# Altium schematic sheet Channel.SchDoc: CDR, Fanout, D-FF
size 420 x 297 mm; CheckedBy: E.Orzes F.Martina S.Baron; CompanyName: CERN; DrawnBy: E.Orzes; Organization: CERN; Address1: European Organization for Nuclear Research; Address2: CH-1211 Genève 23 - Switzerland; SheetNumber: 6; SheetTotal: 7; Projet: Phase Stable Link; DivGrp: EP-ESE; Designer: E.Orzes; ModifiedDate: -
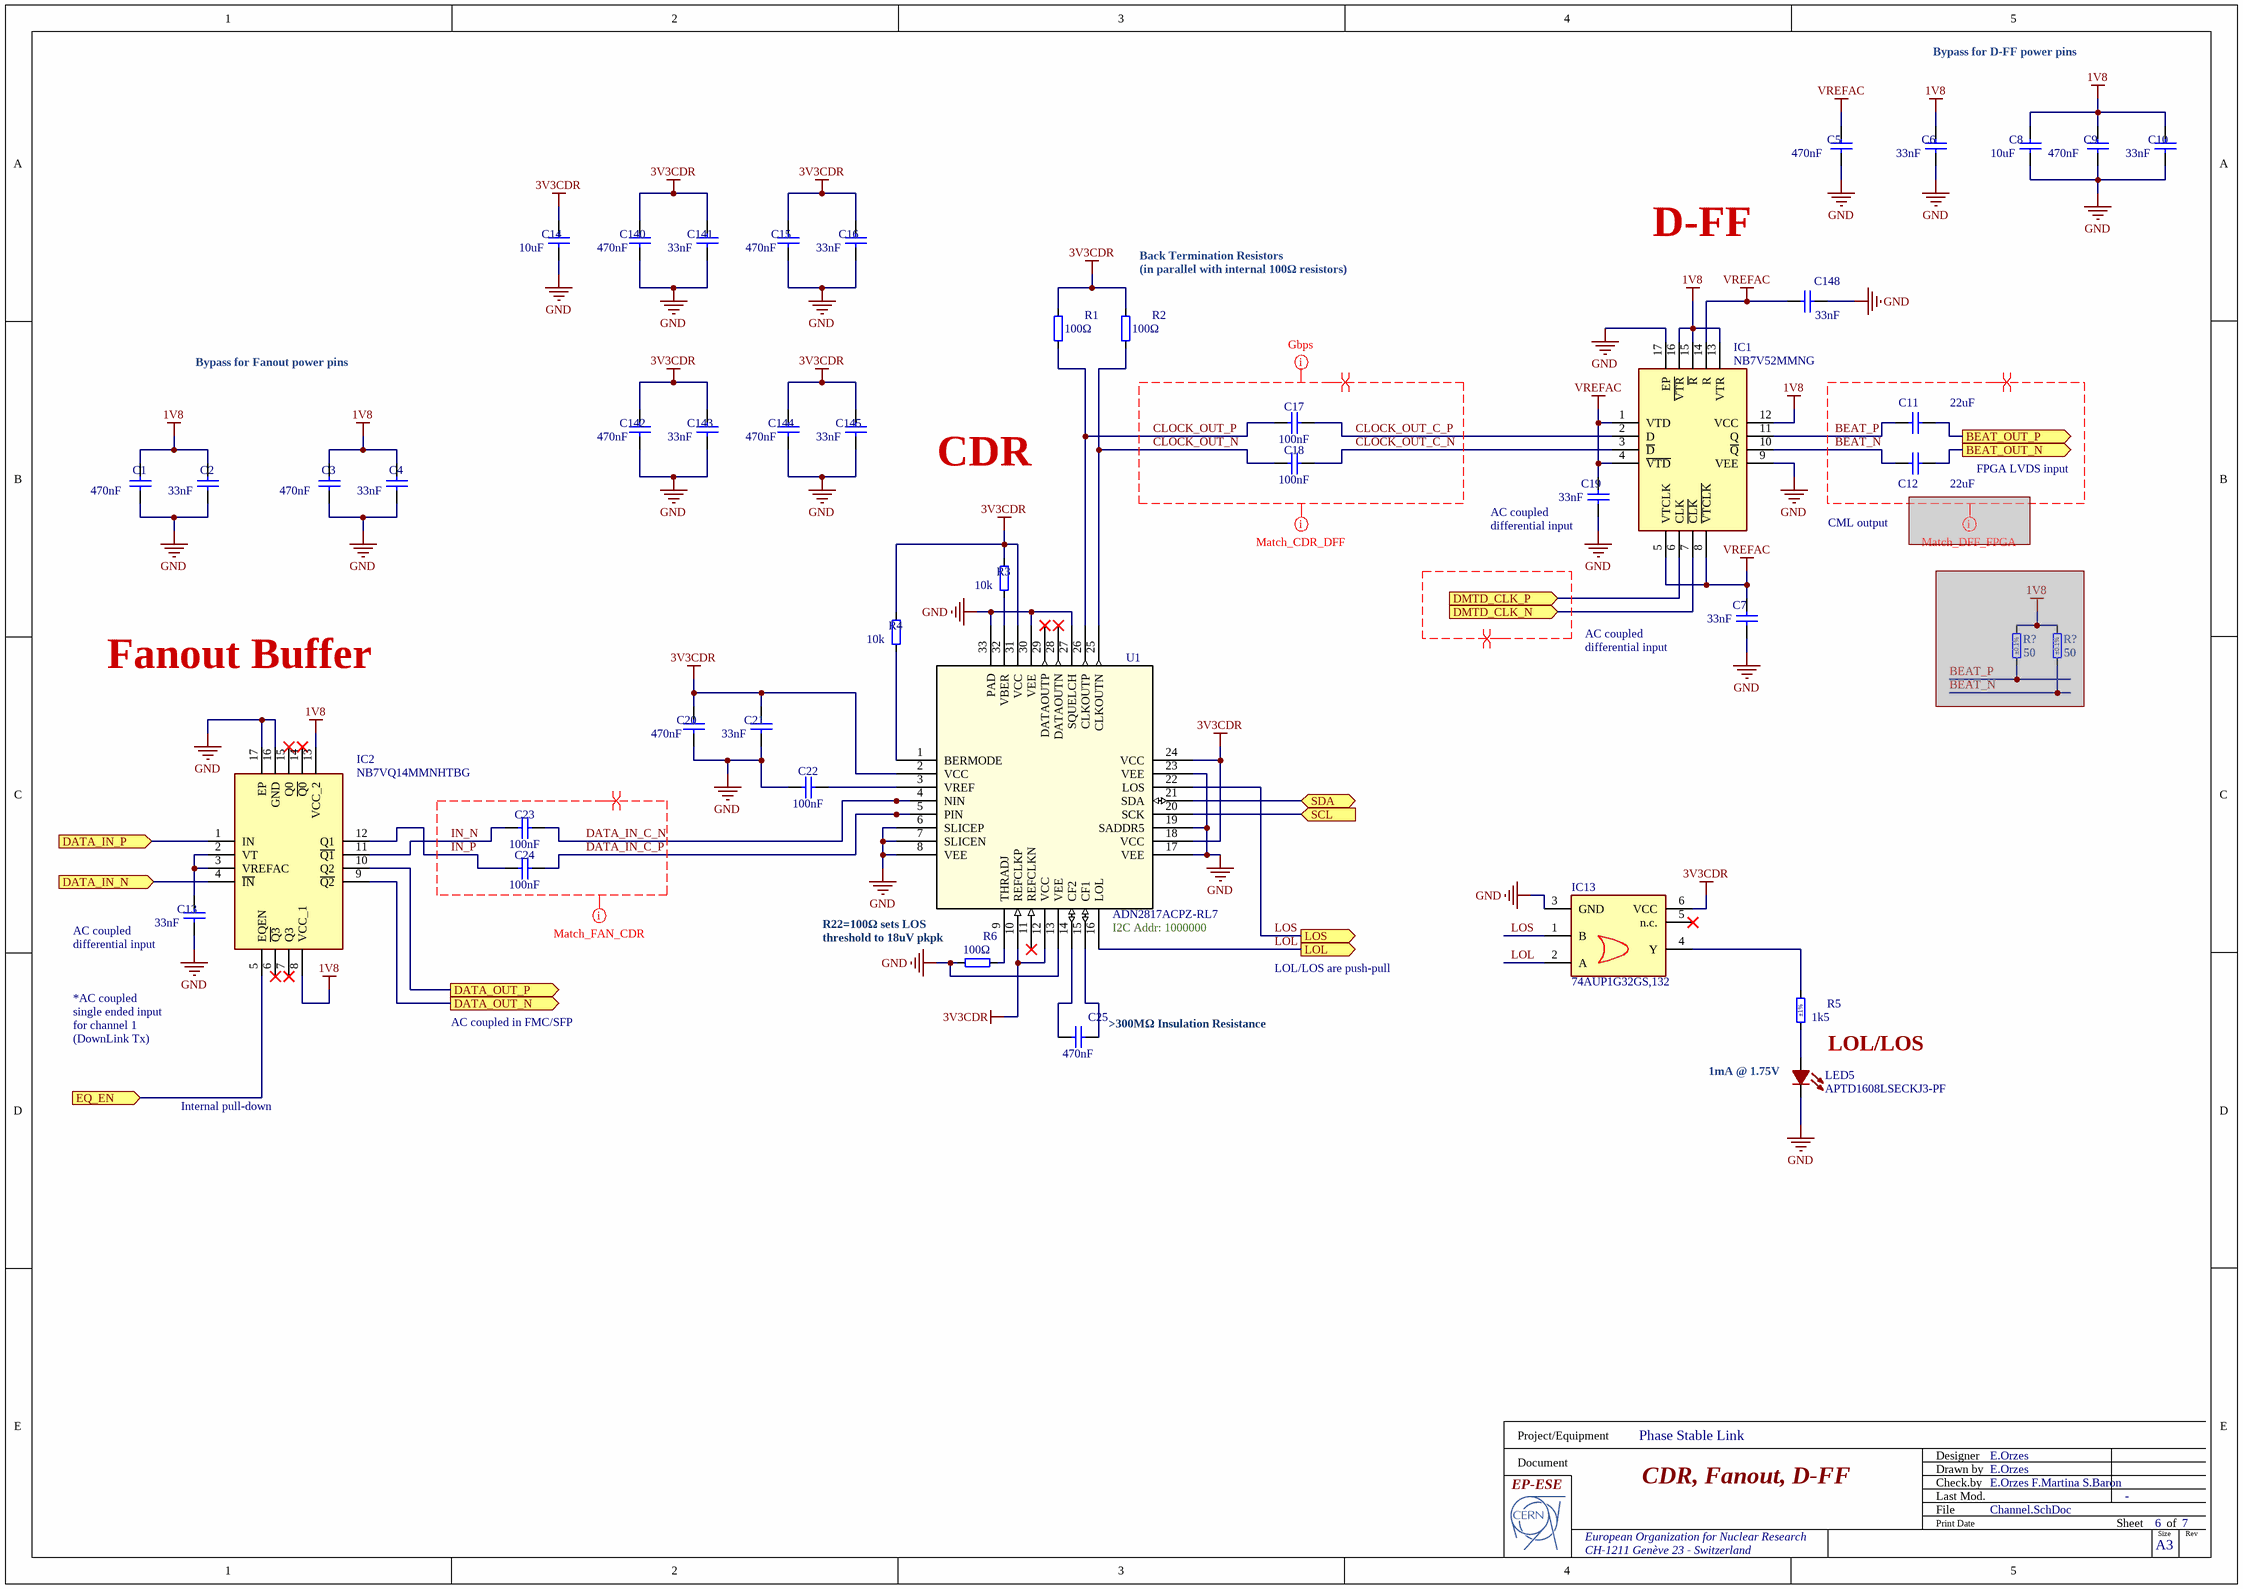
[diagram p0: Channel.SchDoc]

## Parts
(Parts that share a designator on the sheet are numbered #1, #2 ... from top to bottom, then left to right.)
C1  470nF  [CAPC0510X04N]
C2  33nF  [LLL03TR61E333KE01]
C3  470nF  [CAPC0510X04N]
C4  33nF  [LLL03TR61E333KE01]
C5  470nF  [CAPC0510X04N]
C6  33nF  [LLL03TR61E333KE01]
C7  33nF  [LLL03TR61E333KE01]
C8  10uF  [CAPC1608X87N]
C9  470nF  [CAPC0510X04N]
C10  33nF  [LLL03TR61E333KE01]
C11  22uF  [MURATA_HI_DENSITY_0402_CAP]
C12  22uF  [MURATA_HI_DENSITY_0402_CAP]
C13  33nF  [LLL03TR61E333KE01]
C14  10uF  [CAPC1608X87N]
C15  470nF  [CAPC0510X04N]
C16  33nF  [LLL03TR61E333KE01]
C17  100nF  [MURATA_HI_DENSITY_0201]
C18  100nF  [MURATA_HI_DENSITY_0201]
C19  33nF  [LLL03TR61E333KE01]
C20  470nF  [CAPC0510X04N]
C21  33nF  [LLL03TR61E333KE01]
C22  100nF  [MURATA_HI_DENSITY_0201]
C23  100nF  [MURATA_HI_DENSITY_0201]
C24  100nF  [MURATA_HI_DENSITY_0201]
C25  470nF  [CAPC2013X140N]
C140  470nF  [CAPC0510X04N]
C141  33nF  [LLL03TR61E333KE01]
C142  470nF  [CAPC0510X04N]
C143  33nF  [LLL03TR61E333KE01]
C144  470nF  [CAPC0510X04N]
C145  33nF  [LLL03TR61E333KE01]
C148  33nF  [LLL03TR61E333KE01]
IC1  NB7V52MMNG  [QFN50P300X300X100-17N]
IC2  NB7VQ14MMNHTBG  [QFN50P300X300X100-17N]
IC13  74AUP1G32GS,132  [74LVC1G3157GS132]
LED5  APTD1608LSECKJ3-PF  [LED_APTD1608LSECKJ3-PF_KNB]
R1  100Ω  [MURATA_HI_DENSITY_0201]
R2  100Ω  [MURATA_HI_DENSITY_0201]
R3  10k  [MURATA_HI_DENSITY_0201]
R4  10k  [MURATA_HI_DENSITY_0201]
R5  1k5  Tolerance: ±1%  [RESC1005X40N]
R6  100Ω  [MURATA_HI_DENSITY_0201]
R?#1  50  Tolerance: ±0.1%  [RESC1005X35N]  (masked out: inside a compile mask, not in the netlist)
R?#2  50  Tolerance: ±0.1%  [RESC1005X35N]  (masked out: inside a compile mask, not in the netlist)
U1  ADN2817ACPZ-RL7  [CP_32_11_ADI]

## Ports
BEAT_OUT_N (out), BEAT_OUT_P (out), DATA_IN_N (in), DATA_IN_P (in), DATA_OUT_N (out), DATA_OUT_P (out), DMTD_CLK_N (in), DMTD_CLK_P (in), EQ_EN (in), LOL (out), LOS (out), SCL (in), SDA (bidir)

## Nets
1V8: C1.2 C2.2 C3.2 C4.2 C6.2 C8.2 C9.2 C10.2 IC1.12(VCC) IC1.13(VTR) IC1.15(~{R}) IC1.16(~{VTR}) IC2.8(VCC_1) IC2.13(VCC_2)
3V3CDR: C14.2 C15.2 C16.2 C20.2 C21.2 C140.2 C141.2 C142.2 C143.2 C144.2 C145.2 IC13.6(VCC) R1.2 R2.2 R3.2 R4.2 U1.2(VCC) U1.10(REFCLKP) U1.12(VCC) U1.18(VCC) U1.24(VCC) U1.31(VCC)
GND: C1.1 C2.1 C3.1 C4.1 C5.1 C6.1 C7.1 C8.1 C9.1 C10.1 C13.1 C14.1 C15.1 C16.1 C19.1 C20.1 C21.1 C22.1 C140.1 C141.1 C142.1 C143.1 C144.1 C145.1 C148.1 IC1.9(VEE) IC1.17(EP) IC2.16(GND) IC2.17(EP) IC13.3(GND) LED5.1(C) R6.1 U1.6(SLICEP) U1.7(SLICEN) U1.8(VEE) U1.13(VEE) U1.17(VEE) U1.19(SADDR5) U1.23(VEE) U1.27(SQUELCH) U1.30(VEE) U1.33(PAD)
VREFAC: C5.2 C7.2 C19.2 C148.2 IC1.1(VTD) IC1.4(~{VTD}) IC1.5(VTCLK) IC1.8(~{VTCLK}) IC1.14(R)
BEAT_N: C12.2 IC1.10(~{Q})
BEAT_OUT_N: C12.1 ; port BEAT_OUT_N
BEAT_OUT_P: C11.1 ; port BEAT_OUT_P
BEAT_P: C11.2 IC1.11(Q)
CLOCK_OUT_C_N: C18.2 IC1.3(~{D})
CLOCK_OUT_C_P: C17.2 IC1.2(D)
CLOCK_OUT_N: C18.1 R2.1 U1.25(CLKOUTN)
CLOCK_OUT_P: C17.1 R1.1 U1.26(CLKOUTP)
DATA_IN_C_N: C23.2 U1.4(NIN)
DATA_IN_C_P: C24.2 U1.5(PIN)
DATA_IN_N: IC2.4(~{IN}) ; port DATA_IN_N
DATA_IN_P: IC2.1(IN) ; port DATA_IN_P
DATA_OUT_N: IC2.9(~{Q2}) ; port DATA_OUT_N
DATA_OUT_P: IC2.10(Q2) ; port DATA_OUT_P
DMTD_CLK_N: IC1.7(~{CLK}) ; port DMTD_CLK_N
DMTD_CLK_P: IC1.6(CLK) ; port DMTD_CLK_P
EQ_EN: IC2.5(EQEN) ; port EQ_EN
IN_N: C23.1 IC2.11(~{Q1})
IN_P: C24.1 IC2.12(Q1)
LOL: IC13.2(A) U1.16(LOL) ; port LOL
LOS: IC13.1(B) U1.22(LOS) ; port LOS
SCL: U1.20(SCK) ; port SCL
SDA: U1.21(SDA) ; port SDA
NetC13_2: C13.2 IC2.2(VT) IC2.3(VREFAC)
NetC22_2: C22.2 U1.3(VREF)
NetC25_1: C25.1 U1.14(CF2)
NetC25_2: C25.2 U1.15(CF1)
NetIC13_4: IC13.4(Y) R5.2
NetLED5_2: LED5.2(A) R5.1
NetR3_1: R3.1 U1.32(VBER)
NetR4_1: R4.1 U1.1(BERMODE)
NetR6_2: R6.2 U1.9(THRADJ)

Not connected (* = marked no-connect by the designer): IC2 6(~{Q3})* 7(Q3)* 14(~{Q0})* 15(Q0)*; IC13 5(n.c.)*; U1 11(REFCLKN)* 28(DATAOUTN)* 29(DATAOUTP)*

## Layout directives
differential pair: (no net found under the mark), BEAT_N, BEAT_P, CLOCK_OUT_C_N, CLOCK_OUT_C_P, CLOCK_OUT_N, CLOCK_OUT_P, DATA_IN_C_N, DATA_IN_C_P, IN_N, IN_P
net class Match_DFF_FPGA: BEAT_N, BEAT_P
mark named Gbps: CLOCK_OUT_C_N, CLOCK_OUT_C_P, CLOCK_OUT_N, CLOCK_OUT_P
net class Match_CDR_DFF: CLOCK_OUT_C_N, CLOCK_OUT_C_P, CLOCK_OUT_N, CLOCK_OUT_P
net class Match_FAN_CDR: DATA_IN_C_N, DATA_IN_C_P, IN_N, IN_P

## Notes on the sheet
- Bypass for D-FF power pins
- D-FF
- (near R2) Back Termination Resistors
  (in parallel with internal 100Ω resistors)
- Bypass for Fanout power pins
- CDR
- (near C19) AC coupled
  differential input
- CML output
- FPGA LVDS input
- AC coupled
  differential input
- Fanout Buffer
- (near U1) R22=100Ω sets LOS threshold to 18uV pkpk
- (near U1) I2C Addr: 1000000
- (near C13) AC coupled
  differential input
- LOL/LOS are push-pull
- *AC coupled
  single ended input
  for channel 1 (DownLink Tx)
- AC coupled in FMC/SFP
- (near C25) >300MΩ Insulation Resistance
- (near LED5) 1mA @ 1.75V
- LOL/LOS
- Internal pull-down
- Project/Equipment
- Document
- Designer
- Drawn by
- Check.by
- File
- Last Mod.
- Print Date
- Sheet
- Size
- A3
- of
- Rev

## Library data of the parts
C1 C3 C5 C9 C15 C20 C140 C142 C144 = Capacitor - non polarized: LLL153C70G474ME17; Value: 470nF
C2 C4 C6 C7 C10 C13 C16 C19 C21 C141 C143 C145 C148 = Capacitor - non polarized: LLL03TR61E333KE01; Value: 33nF
C8 C14 = CC0603_10UF_6.3V_20%_X5R: C1608X5R1E106M080AC; Part Description: SMD Multilayer Chip Ceramic Capacitor; Manufacturer: GENERIC; Manufacturer1 Part Number: C0603C106M9PAC; Voltage: 6.3V; TC: X5R; Tolerance: ±20%; Part Number: CC0603_10UF_6.3V_20%_X5R; Component Kind: Standard; Component Type: Standard; Pin Count: 2; Value: 10uF; Status: Preferred; Manufacturer Part Number: CC0603_10uF_6.3V_20%_X5R; Case: 0603; Mounted: Yes; Socket: No; SMD: Yes; Sense: No; Manufacturer1 Example: KEMET; Manufacturer1 ComponentHeight: 0.95mm; HelpURL: \\cern.ch\dfs\Applications\Altium\Datasheets\CC0603_X5R_KEMET.pdf; Author: CERN DEM JLC; CreateDate: 03/12/2007; LatestRevisionDate: 03/12/2007
C11 C12 = C0402-22uF-high-density: GRM155R60J226ME11; Vmax: 6.3V; Value: 22uF
C17 C18 C22-C24 = C0201-100nF-high-density: GRM033R61C104KE14; Vmax: 16V; Value: 100nF
C25 = CC0805_470NF_50V_10%_X7R_MURATA_GCM21BR71H474KA55L: GCM21BR71H474KA55L; Part Description: SMD Chip Monolithic Ceramic Capacitor for Automotive; Manufacturer: MURATA; Voltage: 50V; TC: X7R; Tolerance: ±10%; Part Number: CC0805_470NF_50V_10%_X7R_MURATA_GCM21BR71H474KA55L; Component Kind: Standard; Component Type: Standard; Pin Count: 2; Value: 470nF; Status: Not Recommended; Manufacturer Part Number: GCM21BR71H474KA55L; Case: 0805; Mounted: Yes; Socket: No; SMD: Yes; Sense: No; ComponentHeight: 1.4mm; HelpURL: \\cern.ch\dfs\Applications\Altium\Datasheets\CC0805_MURATA_GCM21BR71H474KA55L.pdf; Author: CERN DEM JLC; CreateDate: 5/10/2017; LatestRevisionDate: 5/10/2017
IC1 = NB7V52MMNG: Integrated Circuit; Manufacturer_Name: onsemi; Datasheet Link: https://www.onsemi.com/pdf/datasheet/nb7v52m-d.pdf; Height: 1mm; Manufacturer_Part_Number: NB7V52MMNG; Mouser Part Number: 863-NB7V52MMNG; Mouser Price/Stock: https://www.mouser.co.uk/ProductDetail/ON-Semiconductor/NB7V52MMNG?qs=N5dOQkml4H8i91m%252BmwlaUQ%3D%3D; Arrow Part Number: NB7V52MMNG; Arrow Price/Stock: https://www.arrow.com/en/products/nb7v52mmng/on-semiconductor
IC2 = NB7VQ14MMNHTBG: Integrated Circuit; Manufacturer_Name: onsemi; Datasheet Link: http://www.onsemi.com/pub/Collateral/NB7VQ14M-D.PDF; Height: 1mm; Manufacturer_Part_Number: NB7VQ14MMNHTBG; Mouser Part Number: 863-NB7VQ14MMNHTBG; Mouser Price/Stock: https://www.mouser.co.uk/ProductDetail/onsemi/NB7VQ14MMNHTBG?qs=3PKVEWFFm2%2FWq%2FFZ4xstfg%3D%3D; Arrow Part Number: NB7VQ14MMNHTBG; Arrow Price/Stock: https://www.arrow.com/en/products/nb7vq14mmnhtbg/on-semiconductor?utm_currency=USD&region=nac
IC13 = 74AUP1G32GS,132: Integrated Circuit; Manufacturer_Name: Nexperia; Datasheet Link: https://assets.nexperia.com/documents/data-sheet/74AUP1G32.pdf; Height: 0.35mm; Manufacturer_Part_Number: 74AUP1G32GS,132; Mouser Part Number: 771-74AUP1G32GS132; Mouser Price/Stock: https://www.mouser.com/Search/Refine.aspx?Keyword=771-74AUP1G32GS132
LED5 = APTD1608LSECKJ3-PF: Led Red 0603 2mA 1.8V 50mcd 84mW; Mfr_Name: Kingbright
R1 R2 R6 = R0201-100ohm-high-density: Resistor; Value: 100Ω
R3 R4 = R0201-100ohm-high-density: Resistor 10k; Value: 100Ω
R5 = R0402_1K5_1%_0.0625W_100PPM: Resistor - 1%; Part Description: General Purpose Thick Film Chip Resistor; Manufacturer: GENERIC; Manufacturer1 Part Number: 232270671502L; TC: ±100ppm/°C; PressFit: No; Part Number: R0402_1K5_1%_0.0625W_100PPM; Component Kind: Standard; Component Type: Standard; Pin Count: 2; Value: 1k5; Status: Not Recommended; Power: 0.0625W; Manufacturer Part Number: R0402_1K5_1%_0.0625W_100PPM; Case: 0402; Mounted: Yes; Sense: No; Socket: No; SMD: Yes; Manufacturer1 Example: YAGEO PHYCOMP; Manufacturer1 ComponentHeight: 0.4mm; HelpURL: \\cern.ch\dfs\Applications\Altium\Datasheets\R0402_Phycomp_RC0402.pdf; Author: CERN DEM JLC; CreateDate: 12/3/2007; LatestRevisionDate: 10/17/2012
R?#1 R?#2 = R0402_50R_0.1%_0.05W_25PPM: Resistor - 0.1%; Part Description: Thin Film Precision Resistor; Manufacturer: GENERIC; Manufacturer1 Part Number: FC0402E50R0BTBS; Power: 0.05W; TC: ±25ppm/°C; PressFit: No; Part Number: R0402_50R_0.1%_0.05W_25PPM; Component Kind: Standard; Component Type: Standard; Pin Count: 2; Value: 50; Status: Not Recommended; Manufacturer Part Number: R0402_50R_0.1%_0.05W_25PPM; Case: 0402; Mounted: Yes; Sense: No; Socket: No; SMD: Yes; Manufacturer1 Example: VISHAY DALE; Manufacturer1 ComponentHeight: 0.38mm; HelpURL: \\cern.ch\dfs\Applications\Altium\Datasheets\R0402_VISHAY_FC.pdf; Author: CERN DEM JMW; CreateDate: 8/11/2016; LatestRevisionDate: 8/11/2016
U1 = ADN2817ACPZ-RL7: No Description Available; Mfr_Name: Analog Devices Inc; RefDes: RefDes; Type: Type